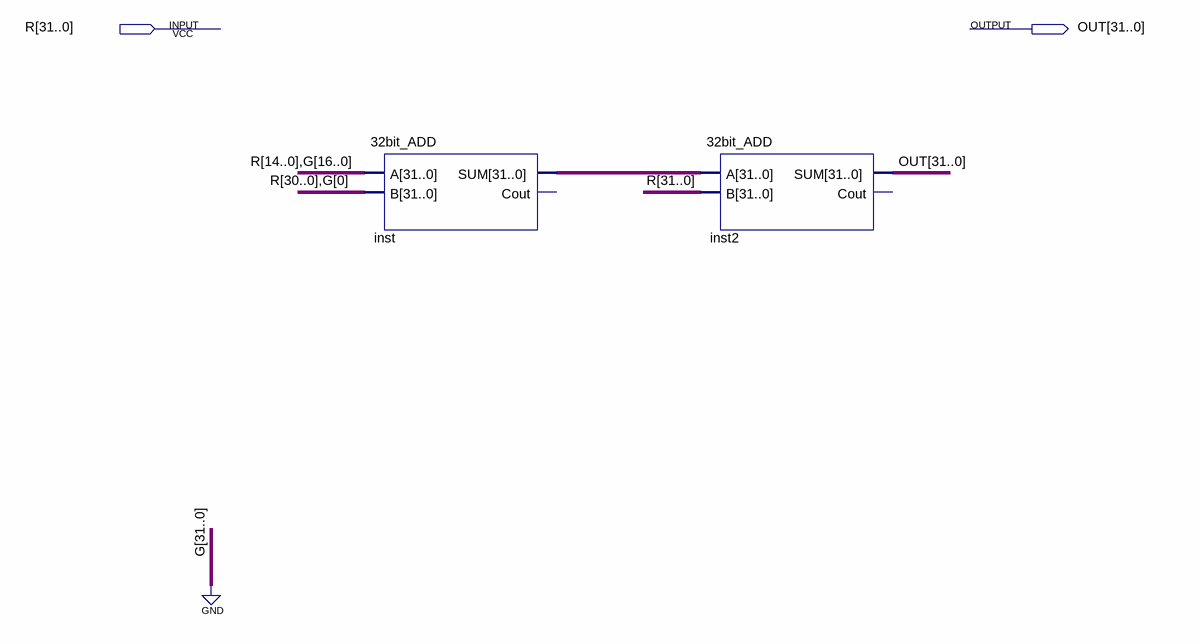
[diagram p0: schematic sheet]
// Quartus schematic RANDU.bdf as structural Verilog: 2 symbols, 2 pins
module RANDU (
  input  [31:0] R,
  output [31:0] OUT
);

  wire [31:0] inst_sum;

  \32bit_ADD  inst (.A({R[14:0], {17{1'b0}}}), .B({R[30:0], 1'b0}), .SUM(inst_sum));  // open: Cout
  \32bit_ADD  inst2 (.A(inst_sum), .B(R), .SUM(OUT));  // open: Cout
endmodule
